# EAGLE design relay_mcu (EAGLE 7.1.0)
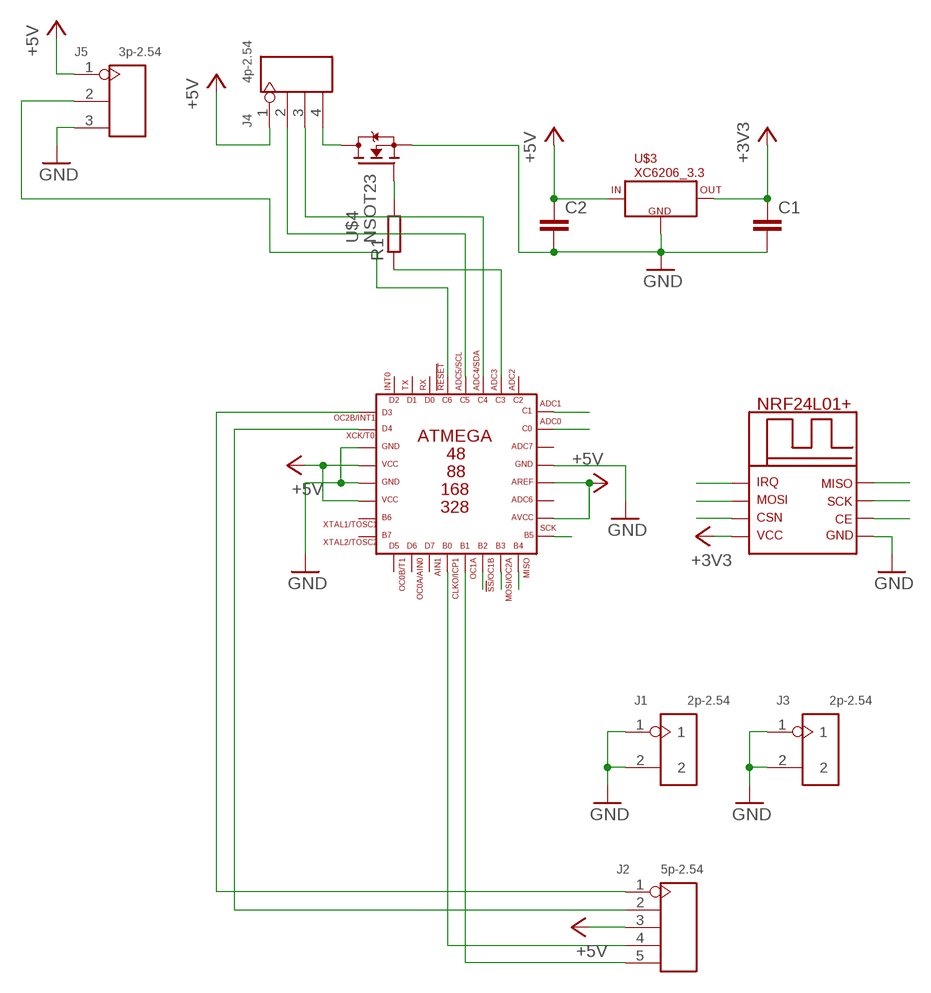
[diagram p0: schematic, sheet 1]

## Parts
C1  C-EUC0805  [C0805]
C2  C-EUC0805  [C0805]
J1  2p-2.54  DIP-BLACK-FEMALE-HEADER-VERT(2P-2.54)  [H2-2.54]
J2  5p-2.54  DIP-BLACK-FEMALE-HEADER-VERT(5P-2.54)  [H5-2.54]
J3  2p-2.54  DIP-BLACK-FEMALE-HEADER-VERT(2P-2.54)  [H2-2.54]
J4  4p-2.54  DIP-BLACK-FEMALE-HEADER-VERT(4P-2.54)  [H4-2.54]
J5  3p-2.54  DIP-BLACK-FEMALE-HEADER-VERT(3P-2.54)  [H3-2.54]
R1  R-EU_R0805  [R0805]
U$1  ATMEGAN8  [TQFP32-08]
U$2  NRF24  [NRF]
U$3  XC6206_3.3  [SOT23]
U$4  NSOT23  [SOT23W]

## Nets
+3V3: C1.1 U$2.VCC U$3.2(OUT)
+5V: J4.1 J5.1
CE: U$1.C1 U$2.CE
CSN: U$1.C0 U$2.CSN
GND: C1.2 C2.2 J1.1 J1.2 J3.1 J3.2 J5.3 U$1.GND U$1.GND1 U$1.GND2 U$2.GND U$3.1(GND) U$4.S
IRQ: U$1.B2 U$2.IRQ
MISO: U$1.B4 U$2.MISO
MOSI: U$1.B3 U$2.MOSI
N$1: C2.1 J2.3 U$1.AREF U$1.AVCC U$1.VCC U$1.VCC1 U$3.3(IN) ; supply symbol labelled +5V
N$2: J2.5 U$1.B1
N$3: J2.4 U$1.B0
N$4: J2.1 U$1.D3
N$5: J2.2 U$1.D4
N$6: J4.2 U$1.C5
N$7: J4.3 U$1.C4
N$9: J4.4 U$4.D
N$10: R1.2 U$4.G
N$11: R1.1 U$1.C3
N$12: J5.2 U$1.C6
SCLK: U$1.B5 U$2.SCK
Unconnected: U$1.ADC6 U$1.ADC7 U$1.B6 U$1.B7 U$1.C2 U$1.D0 U$1.D1 U$1.D2 U$1.D5 U$1.D6 U$1.D7

## Library data of the parts
C1 C2 = rcl:C-EU: CAPACITOR, European symbol
J1 J3 = Seeed-OPL-Connector:DIP-BLACK-FEMALE-HEADER-VERT(2P-2.54): 320030023; MPN: F185-1102A1BSYA1
J2 = Seeed-OPL-Connector:DIP-BLACK-FEMALE-HEADER-VERT(5P-2.54): 320030028; MPN: F185-1105A0BSYA1
J4 = Seeed-OPL-Connector:DIP-BLACK-FEMALE-HEADER-VERT(4P-2.54): 320030017; MPN: F185-1104A1BSYA1
J5 = Seeed-OPL-Connector:DIP-BLACK-FEMALE-HEADER-VERT(3P-2.54): 320030024; MPN: F185-1103A0BSYA1
R1 = rcl:R-EU_: RESISTOR, European symbol
U$1 = My Atmel:ATMEGAN8
U$2 = NRF24l01+:NRF24
U$3 = 74xx:XC6206_3.3
U$4 = Mosfet_Logic:NSOT23

## Board
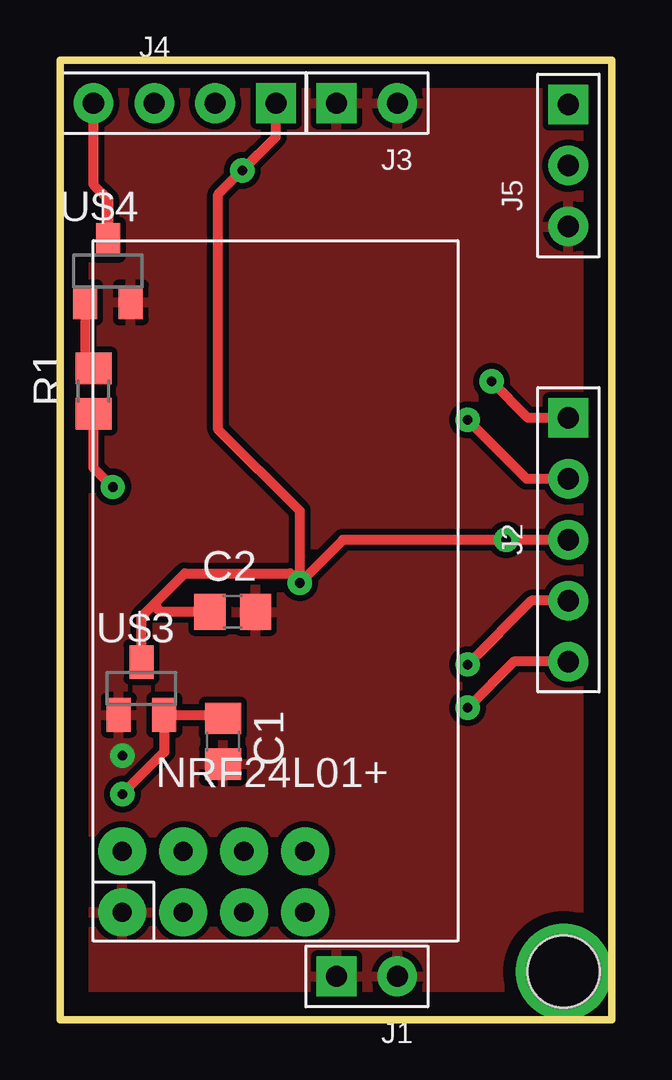
[diagram p1: board, top side]
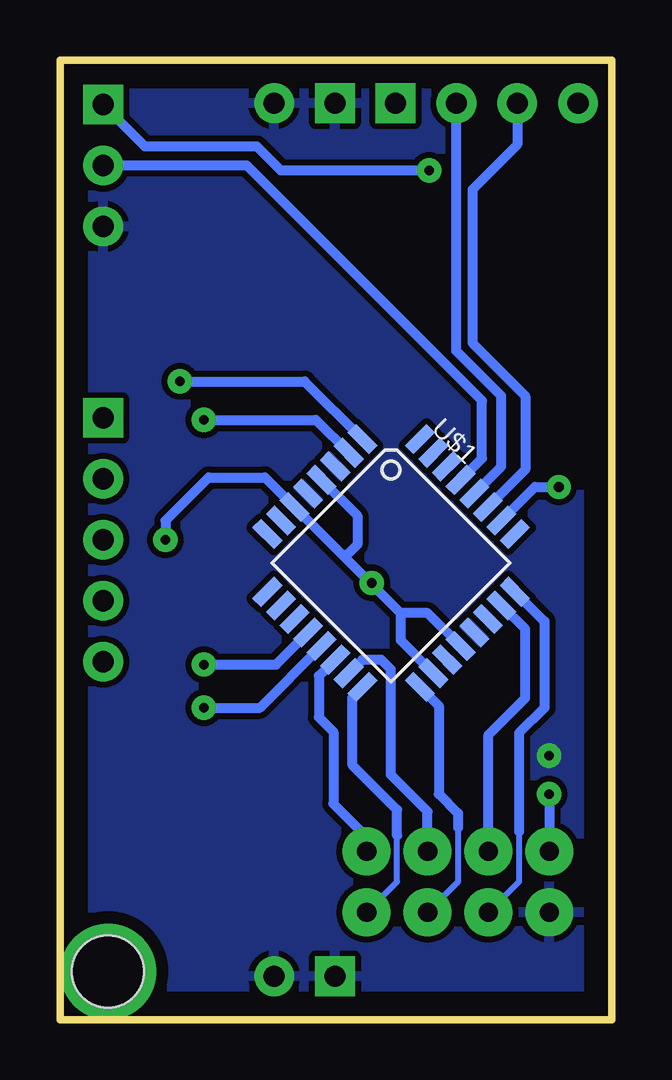
[diagram p2: board, bottom side, seen from below]

Size 23 x 40 mm. Coordinates in mm from the lower left corner, seen from the top.
Outline: 0,0 23,0 23,40 0,40 0,0
Copper layers (1*16): Top 0.035mm / dielectric 1.5mm / Bottom 0.035mm
Design rules "default": minimum track width 10mil, minimum drill 24mil, track to track 8mil, track to pad 8mil, pad to pad 8mil, via to via 8mil, smd to smd 8mil, copper to edge 40mil, drill to drill 8mil, minimum pad ring 10mil, minimum via ring 8mil, stop-mask expansion 4mil, vias tented up to drill 0mil, thermal gap 10mil
Holes 3 mm at 21,2

### Footprints (pad centres in the part's own frame; a part is rotated, then mirrored left to right if it is on the bottom)
C0805 = smd 1.3 x 1.5: 1 -0.95,0; 2 0.95,0
H2-2.54 = drill 0.889 pad 1.651 square: 1 0,1.27 | drill 0.889 pad 1.651: 2 0,-1.27
H5-2.54 = drill 0.889 pad 1.651 square: 1 0,5.08 | drill 0.889 pad 1.651: 2 0,2.54; 3 0,0; 4 0,-2.54; 5 0,-5.08
H4-2.54 = drill 0.889 pad 1.651 square: 1 0,3.81 | drill 0.889 pad 1.651: 2 0,1.27; 3 0,-1.27; 4 0,-3.81
H3-2.54 = drill 0.889 pad 1.651 square: 1 0,2.54 | drill 0.889 pad 1.651: 2 0,0; 3 0,-2.54
R0805 = smd 1.3 x 1.5: 1 -0.95,0; 2 0.95,0
TQFP32-08 = smd 1.27 x 0.508: ADC6 4.5,-1.2; ADC7 4.5,1.2; AREF 4.5,-0.4; AVCC 4.5,-2; B5 4.5,-2.8; B6 -4.5,-2; B7 -4.5,-2.8; C0 4.5,2; C1 4.5,2.8; D3 -4.5,2.8; D4 -4.5,2; GND 4.5,0.4; GND1 -4.5,-0.4; GND2 -4.5,1.2; VCC -4.5,-1.2; VCC1 -4.5,0.4 | smd 0.508 x 1.27: B0 -0.4,-4.5; B1 0.4,-4.5; B2 1.2,-4.5; B3 2,-4.5; B4 2.8,-4.5; C2 2.8,4.5; C3 2,4.5; C4 1.2,4.5; C5 0.4,4.5; C6 -0.4,4.5; D0 -1.2,4.5; D1 -2,4.5; D2 -2.8,4.5; D5 -2.8,-4.5; D6 -2,-4.5; D7 -1.2,-4.5
NRF = drill 0.8 pad 2: CE 3.74,1.2; CSN 3.74,3.74; GND 1.2,1.2; IRQ 8.82,3.74; MISO 8.82,1.2; MOSI 6.28,3.74; SCK 6.28,1.2; VCC 1.2,3.74
SOT23 = smd 1 x 1.4: 1 -0.95,-1.1; 2 0.95,-1.1; 3 0,1.1
SOT23W = smd 1 x 1.4: D 0,1.303; G -0.95,-1.303; S 0.95,-1.303

### Placement (x,y rotation side)
C1  6.8,11.6 270 top
C2  7.2,17 0 top
J1  12.8,1.8 90 top
J2  21.2,20 0 top
J3  12.8,38.2 90 top
J4  5.2,38.2 270 top
J5  21.2,35.6 0 top
R1  1.4,26.2 90 top
U$1  9.19,19.03 315 bottom
U$2  1.39,3.27 0 top
U$3  3.4,13.8 0 top
U$4  2,31.2 0 top

### Tracks (layer width: path | path; a pad name or v marks a point on that pad's centre or on a via)
+3V3  (via drill 0.4 pad 1.02)
  Top 0.406: v2.6,9.4 4.35,11.15 U$3.2 6.65,12.7 C1.1
  Bottom 0.406: v2.6,9.4 U$2.VCC
+5V  (via drill 0.4 pad 1.02)
  Top 0.406: v7.6,35.4 9.01,36.81 J4.1
  Bottom 0.406: J5.1 19.46,36.4 14.8,36.4 13.8,35.4 v7.6,35.4
CE
  Bottom 0.254: 3.86,7.84 3.86,5.74 U$2.CE
  Bottom 0.406: U$1.C1 2.8,16.6 2.8,13 3.86,11.94 3.86,7.84
CSN
  Bottom 0.406: U$2.CSN 5.13,11.87 3.6,13.4 3.6,16.27 U$1.C0
GND  (via drill 0.4 pad 1.02)
  other vias: 2.6,11
  pour Top (isolate 0.254): 0,40 23,40 23,0 0,0
  pour Bottom (isolate 0.254): 23,40 0,40 0,0 23,0
IRQ
  Bottom 0.406: U$1.B2 12.2,14.32 12.2,12.6 11.6,12 11.6,9 10.21,7.61 U$2.IRQ
MISO
  Bottom 0.254: U$2.MISO 8.94,5.74 8.94,7.66
  Bottom 0.406: 8.94,7.66 8.94,8.74 10.8,10.6 10.8,13.46 U$1.B4
MOSI
  Bottom 0.406: U$2.MOSI 7.67,8.67 9.2,10.2 9.2,14.6 9.6,15 10.39,15 U$1.B3
N$1  (via drill 0.4 pad 1.02)
  Top 0.406: J2.3 v18.6,20 11.8,20 v10,18.2 | U$3.3 3.4,16.8 3.9,17.3 | v10,18.2 10,21.2 6.6,24.6 6.6,34.4 9,36.8 9,38.2 | C2.1 4.2,17 3.9,17.3 | 3.9,17.3 5.2,18.6 9.6,18.6 v10,18.2
  Bottom 0.406: 11.23,19.37 U$1.VCC 14.46,22.6 16.8,22.6 18.6,20.8 v18.6,20 | 11.23,19.37 8.8,16.95 | 8.8,16.95 8.8,15.81 U$1.AVCC | U$1.AREF 7.67,16.95 8.8,16.95 | U$1.VCC1 10.6,21.01 10.6,19.8 11.03,19.37 11.23,19.37
N$2  (via drill 0.4 pad 1.02)
  Top 0.406: J2.5 18.92,14.92 v17,13
  Bottom 0.406: v17,13 14.66,13 U$1.B1
N$3  (via drill 0.4 pad 1.02)
  Top 0.406: J2.4 19.66,17.46 v17,14.8
  Bottom 0.406: v17,14.8 13.99,14.8 U$1.B0
N$4  (via drill 0.4 pad 1.02)
  Top 0.406: J2.1 19.52,25.08 v18,26.6
  Bottom 0.406: v18,26.6 12.8,26.6 U$1.D3
N$5  (via drill 0.4 pad 1.02)
  Top 0.406: J2.2 19.46,22.54 v17,25
  Bottom 0.406: v17,25 12.33,25 U$1.D4
N$6
  Bottom 0.406: U$1.C5 4.6,23.06 4.6,26 6.47,27.87 J4.2
N$7
  Bottom 0.406: J4.3 3.93,36.47 5.8,34.6 5.8,28.2 3.6,26 3.6,22.93 U$1.C4
N$9
  Top 0.406: J4.4 1.39,34.81 2,34.2 U$4.D
N$10
  Top 0.406: U$4.G 1.05,27.5 R1.2
N$11  (via drill 0.4 pad 1.02)
  Top 0.406: v2.2,22.2 1.4,23 R1.1
  Bottom 0.406: U$1.C3 3.19,22.2 v2.2,22.2
N$12
  Bottom 0.406: U$1.C6 5.4,23.39 5.4,25.8 15.2,35.6 J5.2
N$13  (via drill 0.4 pad 4)
  other vias: 21,2
SCLK
  Bottom 0.254: 6.4,8 6.4,5.74 U$2.SCK
  Bottom 0.406: U$1.B5 7.2,13.08 7.2,9.4 6.4,8.6 6.4,8